# Altium schematic sheet CarteBouton.SchDoc
size A4
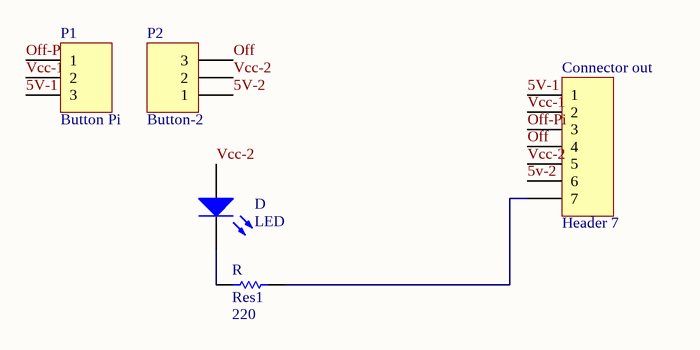
[diagram p0: CarteBouton.SchDoc]

## Parts
Connector_out  Header 7  [HDR1X7]
D  LED  [LED-0]
P1  Button Pi  [HDR1X3]
P2  Button-2  [HDR1X3]
R  Res1  value 220  [AXIAL-0.3]

## Nets
5V-1: Connector_out.1 P1.3
5V-2: Connector_out.6 P2.1
Off: Connector_out.4 P2.3
Off-Pi: Connector_out.3 P1.1
Vcc-1: Connector_out.2 P1.2
Vcc-2: Connector_out.5 D.1(A) P2.2
NetConnector_out_7: Connector_out.7 R.2
NetD_2: D.2(K) R.1

## Library data of the parts
Connector_out = Header 7: Header, 7-Pin; LatestRevisionDate: 17-Jul-2002; LatestRevisionNote: Re-released for DXP Platform.; Publisher: Altium Limited
D = LED0: Typical INFRARED GaAs LED; Published: 8-Jun-2000; LatestRevisionDate: 08-Jul-2005; LatestRevisionNote: Mech Layer 1 removed.; PackageReference: LED-0; Publisher: Altium Limited; PackageDescription: LED; 2 Leads
P1 P2 = Header 3: Header, 3-Pin; LatestRevisionDate: 17-Jul-2002; LatestRevisionNote: Re-released for DXP Platform.; Publisher: Altium Limited
R = Res1: Resistor; Published: 8-Jun-2000; LatestRevisionDate: 17-Jul-2002; LatestRevisionNote: Re-released for DXP Platform.; PackageReference: AXIAL-0.3; Publisher: Altium Limited; PackageDescription: Axial Device, Thru-Hole; 2 Leads; 0.3 in Pin Spacing